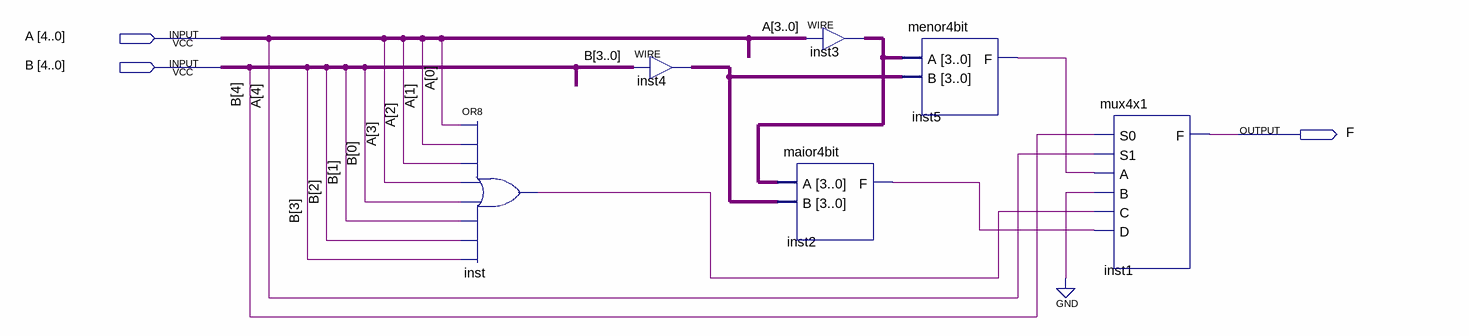
[diagram p0: schematic sheet]
// Quartus schematic menor5sign.bdf as structural Verilog: 6 symbols, 3 pins
module menor5sign (
  input  [4:0] A,
  input  [4:0] B,
  output F
);

  wire inst2_f, inst5_f, inst_out;
  wire [3:0] inst3_out, inst4_out;

  or inst (inst_out, A[0], A[1], A[2], A[3], B[0], B[1], B[2], B[3]);
  assign inst4_out = B[3:0];  // WIRE inst4
  assign inst3_out = A[3:0];  // WIRE inst3
  maior4bit inst2 (.A(inst3_out), .B(inst4_out), .F(inst2_f));
  menor4bit inst5 (.A(inst3_out), .B(inst4_out), .F(inst5_f));
  mux4x1 inst1 (.S0(B[4]), .S1(A[4]), .A(inst5_f), .B(1'b0), .C(inst_out), .D(inst2_f), .F(F));
endmodule
